# Altium schematic sheet AudioADCA.SchDoc
size A4
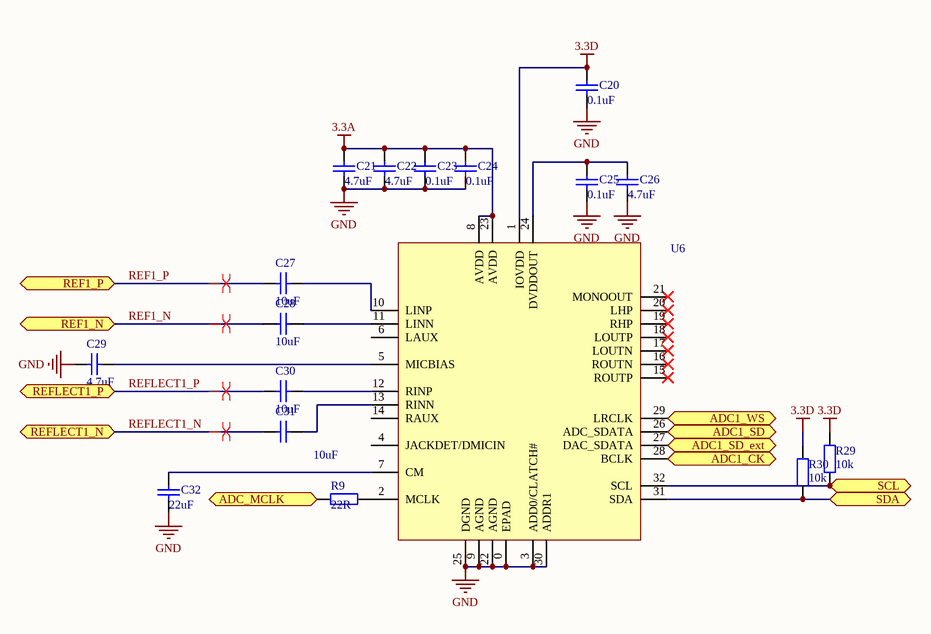
[diagram p0: AudioADCA.SchDoc]

## Parts
C20  0.1uF  [0402]
C21  4.7uF  [0805]
C22  4.7uF  [0805]
C23  0.1uF  [0402]
C24  0.1uF  [0402]
C25  0.1uF  [0402]
C26  4.7uF  [0805]
C27  10uF  [0402]
C28  10uF  [0402]
C29  4.7uF  [0402]
C30  10uF  [0402]
C31  10uF  [0402]
C32  22uF  [0805]
R9  22R  [0402]
R29  value 10k  [0402]  (hidden comment: Res2)
R30  value 10k  [0402]  (hidden comment: Res2)
U6  ADAU1761  [ADAU1761]  (value not drawn)

## Ports
ADC1_CK, ADC1_SD, ADC1_SD_ext, ADC1_WS, ADC_MCLK, REF1_N, REF1_P, REFLECT1_N, REFLECT1_P, SCL, SDA

## Nets
3.3A: C21.2 C22.2 C23.2 C24.2 U6.8(AVDD) U6.23(AVDD)
3.3D: C20.2 R29.2 R30.2 U6.1(IOVDD)
GND: C20.1 C21.1 C22.1 C23.1 C24.1 C25.1 C26.1 C29.1 C32.1 U6.0(EPAD) U6.3(ADD0/CLATCH#) U6.9(AGND) U6.22(AGND) U6.25(DGND) U6.30(ADDR1)
ADC1_CK: U6.28(BCLK) ; port ADC1_CK
ADC1_SD: U6.26(ADC_SDATA) ; port ADC1_SD
ADC1_SD_ext: U6.27(DAC_SDATA) ; port ADC1_SD_ext
ADC1_WS: U6.29(LRCLK) ; port ADC1_WS
ADC_MCLK: R9.2 ; port ADC_MCLK
REF1_N: C28.2 ; port REF1_N
REF1_P: C27.2 ; port REF1_P
REFLECT1_N: C31.1 ; port REFLECT1_N
REFLECT1_P: C30.1 ; port REFLECT1_P
SCL: R29.1 U6.32(SCL) ; port SCL
SDA: R30.1 U6.31(SDA) ; port SDA
NetC25_2: C25.2 C26.2 U6.24(DVDDOUT)
NetC27_1: C27.1 U6.10(LINP)
NetC28_1: C28.1 U6.11(LINN)
NetC29_2: C29.2 U6.5(MICBIAS)
NetC30_2: C30.2 U6.12(RINP)
NetC31_2: C31.2 U6.13(RINN)
NetC32_2: C32.2 U6.7(CM)
NetR9_1: R9.1 U6.2(MCLK)

Not connected (* = marked no-connect by the designer): U6 4(JACKDET/DMICIN) 6(LAUX) 14(RAUX) 15(ROUTP)* 16(ROUTN)* 17(LOUTN)* 18(LOUTP)* 19(RHP)* 20(LHP)* 21(MONOOUT)*

## Layout directives
differential pair: REF1_N, REF1_P, REFLECT1_N, REFLECT1_P

## Library data of the parts
C20-C32 = Cap: Capacitor; Published: 8-Jun-2000; LatestRevisionDate: 17-Jul-2002; LatestRevisionNote: Re-released for DXP Platform.; PackageReference: RAD-0.3; Publisher: Altium Limited; PackageDescription: Radial Cap, Thru-Hole; 2 Leads; 0.3 in Pin Spacing
R9 R29 R30 = Res2: Resistor; Published: 8-Jun-2000; LatestRevisionDate: 17-Jul-2002; LatestRevisionNote: Re-released for DXP Platform.; PackageReference: AXIAL-0.4; Publisher: Altium Limited; PackageDescription: Axial Device, Thru-Hole; 2 Leads; 0.4 in Pin Spacing